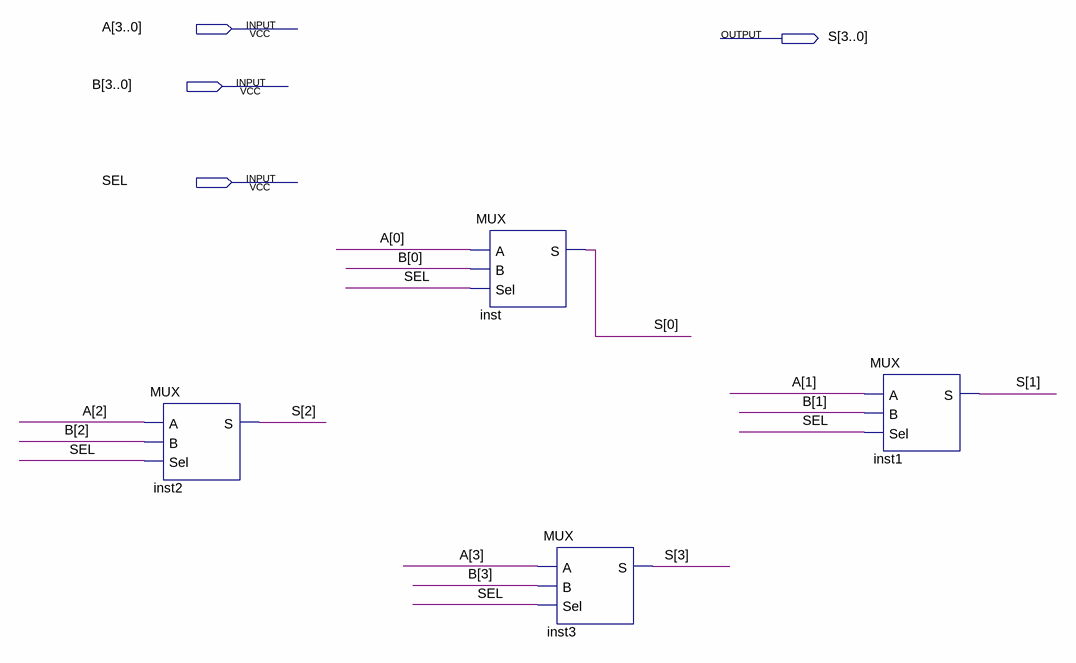
[diagram p0: schematic sheet]
// Quartus schematic Lab05.bdf as structural Verilog: 4 symbols, 4 pins
module Lab05 (
  input  [3:0] A,
  input  [3:0] B,
  input  SEL,
  output [3:0] S
);

  MUX inst2 (.A(A[2]), .B(B[2]), .Sel(SEL), .S(S[2]));
  MUX inst (.A(A[0]), .B(B[0]), .Sel(SEL), .S(S[0]));
  MUX inst3 (.A(A[3]), .B(B[3]), .Sel(SEL), .S(S[3]));
  MUX inst1 (.A(A[1]), .B(B[1]), .Sel(SEL), .S(S[1]));
endmodule
